# Altium schematic sheet Tag104 Rev8.SCHDOC
size 292 x 193 mm; SheetNumber: 0; SheetTotal: 0
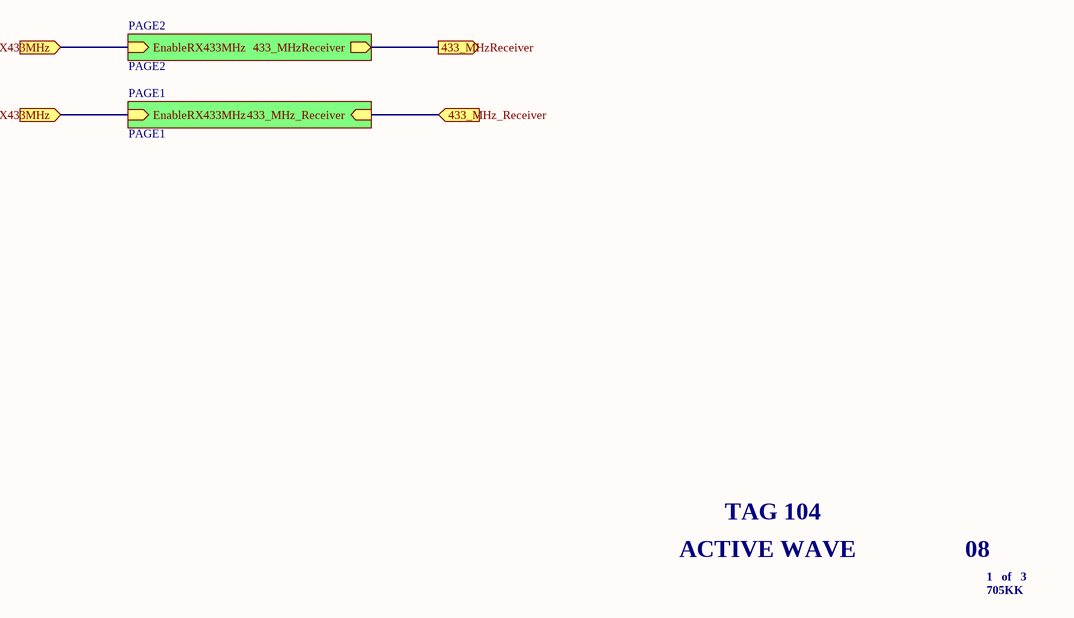
[diagram p0: Tag104 Rev8.SCHDOC]

## Sub-sheets
PAGE1 = PAGE1: EnableRX433MHz (in), 433_MHz_Receiver (in)  | Description: PAGE1
PAGE2 = PAGE2: EnableRX433MHz (in), 433_MHzReceiver (out)  | Description: PAGE2

## Ports
433_MHz_Receiver (in), 433_MHzReceiver (out), EnableRX433MHz (in)

## Nets
433_MHz_Receiver: port 433_MHz_Receiver, sheet PAGE1/433_MHz_Receiver
433_MHzReceiver: port 433_MHzReceiver, sheet PAGE2/433_MHzReceiver
EnableRX433MHz: port EnableRX433MHz, sheet PAGE1/EnableRX433MHz, sheet PAGE2/EnableRX433MHz

## Notes on the sheet
- ACTIVE WAVE
- TAG 104
- 08
- 1   of   3
- 705KK